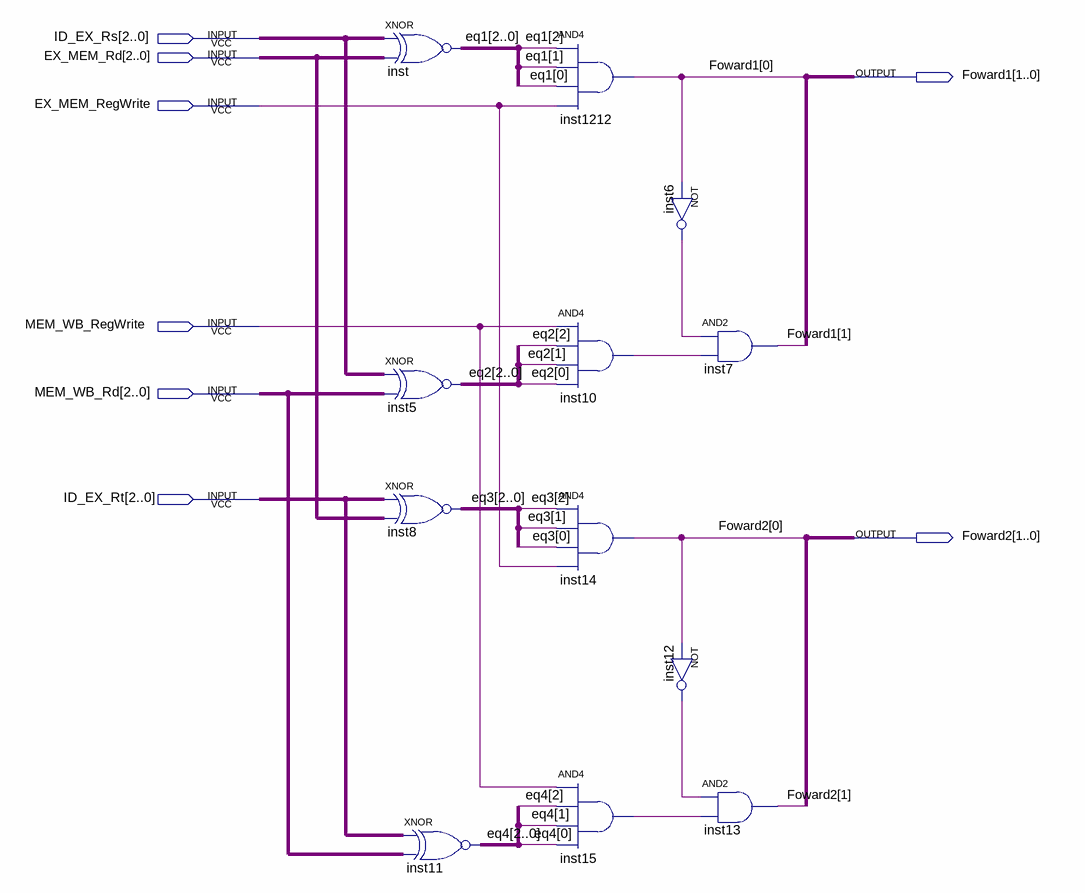
[diagram p0: schematic sheet]
// Quartus schematic ForwardingUnit.bdf as structural Verilog: 12 symbols, 8 pins
module ForwardingUnit (
  input  [2:0] ID_EX_Rs,
  input  [2:0] EX_MEM_Rd,
  input  EX_MEM_RegWrite,
  input  MEM_WB_RegWrite,
  input  [2:0] MEM_WB_Rd,
  input  [2:0] ID_EX_Rt,
  output [1:0] Foward1,
  output [1:0] Foward2
);

  wire inst6_out, inst10_out, inst12_out, inst15_out;
  wire [2:0] eq1, eq2, eq3, eq4;

  assign eq1 = ~(ID_EX_Rs ^ EX_MEM_Rd);  // XNOR inst, 3 bits wide
  assign eq2 = ~(ID_EX_Rs ^ MEM_WB_Rd);  // XNOR inst5, 3 bits wide
  assign eq3 = ~(ID_EX_Rt ^ EX_MEM_Rd);  // XNOR inst8, 3 bits wide
  assign eq4 = ~(ID_EX_Rt ^ MEM_WB_Rd);  // XNOR inst11, 3 bits wide
  and inst1212 (Foward1[0], eq1[2], eq1[1], eq1[0], EX_MEM_RegWrite);
  and inst10 (inst10_out, MEM_WB_RegWrite, eq2[2], eq2[1], eq2[0]);
  and inst14 (Foward2[0], eq3[2], eq3[1], eq3[0], EX_MEM_RegWrite);
  and inst15 (inst15_out, MEM_WB_RegWrite, eq4[2], eq4[1], eq4[0]);
  not inst6 (inst6_out, Foward1[0]);
  not inst12 (inst12_out, Foward2[0]);
  and inst7 (Foward1[1], inst6_out, inst10_out);
  and inst13 (Foward2[1], inst12_out, inst15_out);
endmodule
